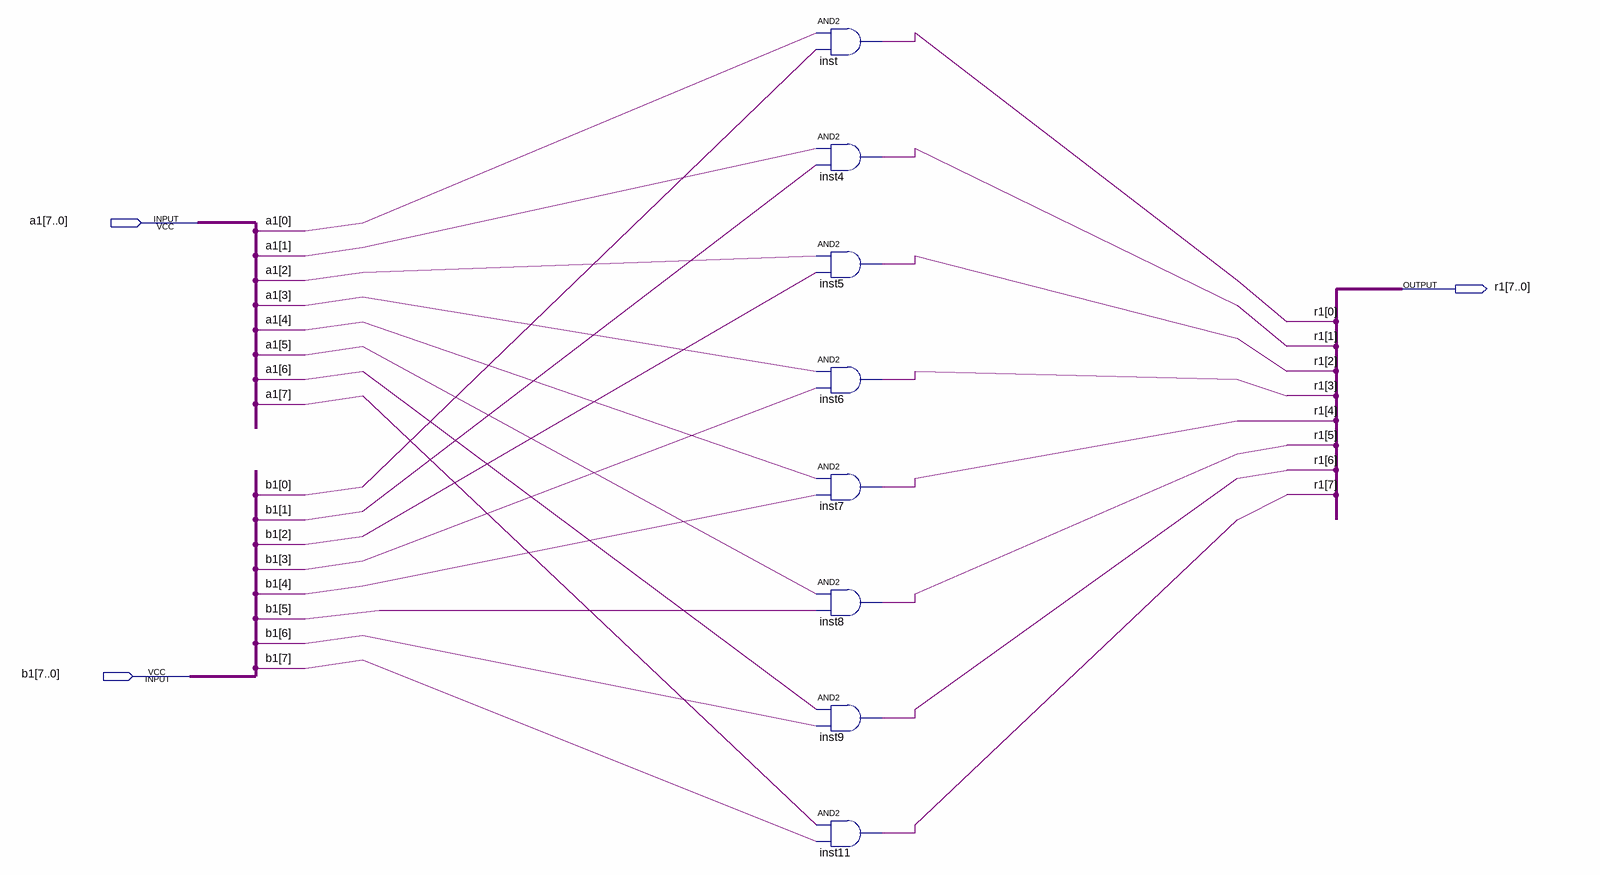
[diagram p0: schematic sheet]
// Quartus schematic and_completo.bdf as structural Verilog: 8 symbols, 3 pins
module and_completo (
  input  [7:0] a1,
  input  [7:0] b1,
  output [7:0] r1
);

  and inst (r1[0], a1[0], b1[0]);
  and inst4 (r1[1], a1[1], b1[1]);
  and inst5 (r1[2], a1[2], b1[2]);
  and inst6 (r1[3], a1[3], b1[3]);
  and inst7 (r1[4], a1[4], b1[4]);
  and inst8 (r1[5], a1[5], b1[5]);
  and inst9 (r1[6], a1[6], b1[6]);
  and inst11 (r1[7], a1[7], b1[7]);
endmodule
